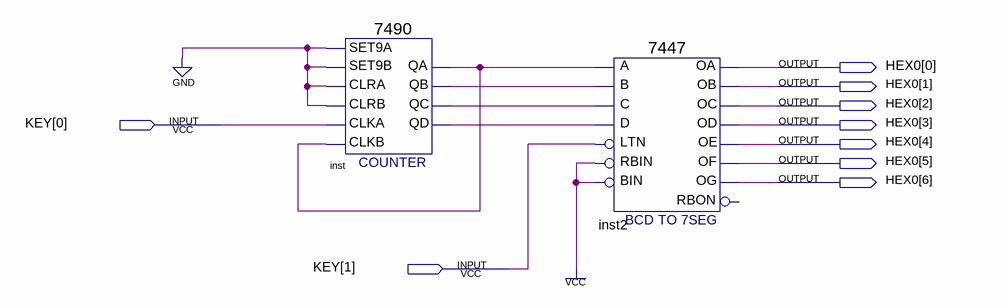
[diagram p0: schematic sheet]
// Quartus schematic Exemplo4.bdf as structural Verilog: 2 symbols, 9 pins
module Exemplo4 (
  input  [1:0] KEY,
  output [6:0] HEX0
);

  wire inst_qa, inst_qb, inst_qc, inst_qd;

  \7490  inst (
    .SET9A(1'b0), .CLRA(1'b0), .SET9B(1'b0), .CLKB(inst_qa), .CLKA(KEY[0]), .CLRB(1'b0), .QD(inst_qd),
    .QA(inst_qa), .QB(inst_qb), .QC(inst_qc));
  \7447  inst2 (
    .LTN(KEY[1]), .B(inst_qb), .C(inst_qc), .D(inst_qd), .RBIN(1'b1), .BIN(1'b1), .A(inst_qa), .OB(HEX0[1]),
    .OC(HEX0[2]), .OE(HEX0[4]), .OD(HEX0[3]), .OF(HEX0[5]), .OG(HEX0[6]), .OA(HEX0[0]));  // open: RBON
endmodule
